# Altium project Athena.PrjPcb
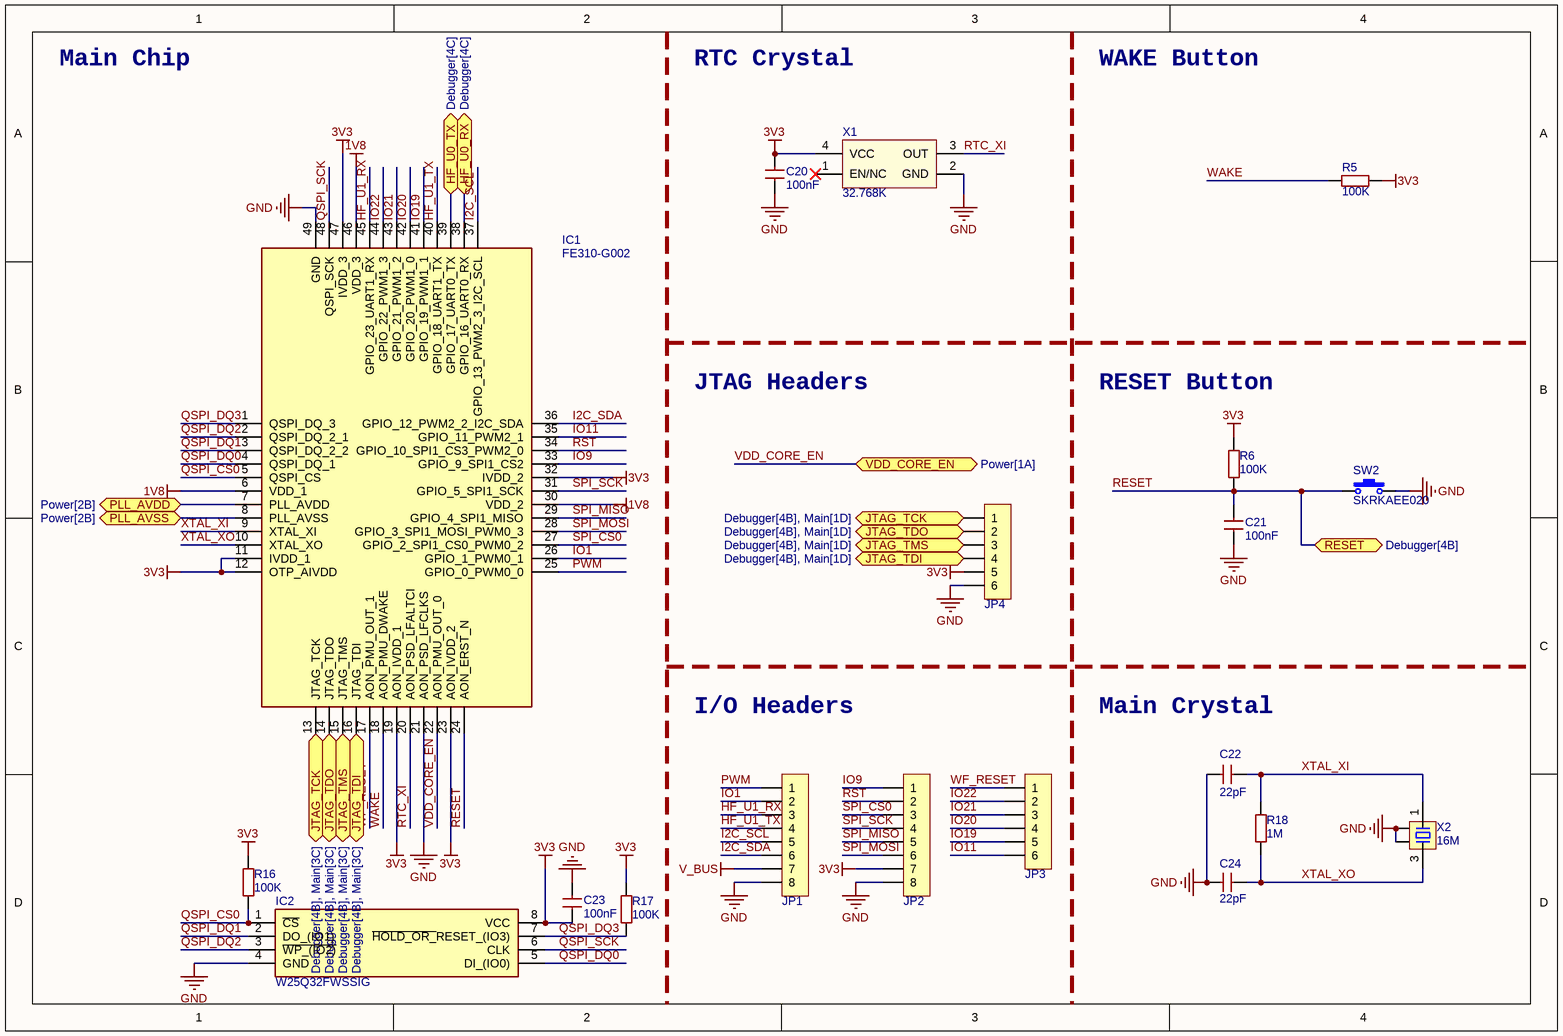
[diagram p0: Main.SchDoc]
3 sheets, 88 parts. Net scope: flat (ports and power ports of the same name join across sheets).
Board file: Board.PcbDoc
Sheets:
  Main.SchDoc
  Power.SchDoc
  Debugger.SchDoc

## Sheet Main.SchDoc
size A4; SheetNumber: 1; SheetTotal: 3

### Parts
C20  100nF  [C0603_NS]
C21  100nF  [C0603_NS]
C22  22pF  [C0603_NS]
C23  100nF  [C0603_NS]
C24  22pF  [C0603_NS]
IC1  FE310-G002  [QFN40P600X600X93-49N]
IC2  W25Q32FWSSIG  [SOIC127P790X216-8N]
JP1  HDR-1X8  [HDR2.54-M-LI-8P]  (value not drawn)
JP2  HDR-1X8  [HDR2.54-M-LI-8P]  (value not drawn)
JP3  HDR-1X6  [HDR2.54-M-LI-6P]  (value not drawn)
JP4  HDR-1X6  [HDR2.54-M-LI-6P]  (value not drawn)
R5  100K  [R0603_NS]
R6  100K  [R0603_NS]
R16  100K  [R0603_NS]
R17  100K  [R0603_NS]
R18  1M  [R0603_NS]
SW2  SKRKAEE020  [SKRKAEE020]
X1  32.768K  [OSC-3225-4P]
X2  16M  [XTAL-3225-4P]

### Ports
HF_U0_RX (bidir, see Debugger[4C]), HF_U0_TX (bidir, see Debugger[4C]), JTAG_TCK (bidir, see Debugger[4B], Main[1D]), JTAG_TCK (bidir, see Debugger[4B], Main[3C]), JTAG_TDI (bidir, see Debugger[4B], Main[1D]), JTAG_TDI (bidir, see Debugger[4B], Main[3C]), JTAG_TDO (bidir, see Debugger[4B], Main[1D]), JTAG_TDO (bidir, see Debugger[4B], Main[3C]), JTAG_TMS (bidir, see Debugger[4B], Main[1D]), JTAG_TMS (bidir, see Debugger[4B], Main[3C]), PLL_AVDD (bidir, see Power[2B]), PLL_AVSS (bidir, see Power[2B]), RESET (bidir, see Debugger[4B]), VDD_CORE_EN (bidir, see Power[1A])

### Nets
1V8: IC1.6(VDD_1) IC1.30(VDD_2) IC1.46(VDD_3)
3V3: C20.2 C23.1 IC1.11(IVDD_1) IC1.12(OTP_AIVDD) IC1.19(AON_IVDD_1) IC1.23(AON_IVDD_2) IC1.32(IVDD_2) IC1.47(IVDD_3) IC2.8(VCC) JP2.7 JP4.5 R5.2 R6.2 R16.2 R17.2 X1.4(VCC)
GND: C20.1 C21.1 C22.1 C23.2 C24.2 IC1.21(AON_PSD_LFCLKS) IC1.49(GND) IC2.4(GND) JP1.8 JP2.8 JP4.6 SW2.2 X1.2(GND) X2.2 X2.4
V_BUS: JP1.7
HF_U1_RX: IC1.45(GPIO_23_UART1_RX) JP1.3
HF_U1_TX: IC1.40(GPIO_18_UART1_TX) JP1.4
I2C_SCL: IC1.37(GPIO_13_PWM2_3_I2C_SCL) JP1.5
I2C_SDA: IC1.36(GPIO_12_PWM2_2_I2C_SDA) JP1.6
IO1: IC1.26(GPIO_1_PWM0_1) JP1.2
IO9: IC1.33(GPIO_9_SPI1_CS2) JP2.1
IO11: IC1.35(GPIO_11_PWM2_1) JP3.6
IO19: IC1.41(GPIO_19_PWM1_1) JP3.5
IO20: IC1.42(GPIO_20_PWM1_0) JP3.4
IO21: IC1.43(GPIO_21_PWM1_2) JP3.3
IO22: IC1.44(GPIO_22_PWM1_3) JP3.2
JTAG_TCK: IC1.13(JTAG_TCK) JP4.1 ; port JTAG_TCK
JTAG_TDI: IC1.16(JTAG_TDI) JP4.4 ; port JTAG_TDI
JTAG_TDO: IC1.14(JTAG_TDO) JP4.2 ; port JTAG_TDO
JTAG_TMS: IC1.15(JTAG_TMS) JP4.3 ; port JTAG_TMS
PLL_AVDD: IC1.7(PLL_AVDD) ; port PLL_AVDD
PLL_AVSS: IC1.8(PLL_AVSS) ; port PLL_AVSS
PWM: IC1.25(GPIO_0_PWM0_0) JP1.1
QSPI_CS0: IC1.5(QSPI_CS) IC2.1(~{CS}) R16.1
QSPI_DQ0: IC1.4(QSPI_DQ_1) IC2.5(DI_(IO0))
QSPI_DQ1: IC1.3(QSPI_DQ_2_2) IC2.2(DO_(IO1))
QSPI_DQ2: IC1.2(QSPI_DQ_2_1) IC2.3(~{WP_(IO2)})
QSPI_DQ3: IC1.1(QSPI_DQ_3) IC2.7(~{HOLD_OR_}RESET_(IO3)) R17.1
QSPI_SCK: IC1.48(QSPI_SCK) IC2.6(CLK)
RESET: C21.2 IC1.24(AON_ERST_N) R6.1 SW2.1 ; port RESET
RST: IC1.34(GPIO_10_SPI1_CS3_PWM2_0) JP2.2
RTC_XI: IC1.20(AON_PSD_LFALTCI) X1.3(OUT)
SPI_CS0: IC1.27(GPIO_2_SPI1_CS0_PWM0_2) JP2.3
SPI_MISO: IC1.29(GPIO_4_SPI1_MISO) JP2.5
SPI_MOSI: IC1.28(GPIO_3_SPI1_MOSI_PWM0_3) JP2.6
SPI_SCK: IC1.31(GPIO_5_SPI1_SCK) JP2.4
UART0_RX: IC1.38(GPIO_16_UART0_RX) ; port HF_U0_RX
UART0_TX: IC1.39(GPIO_17_UART0_TX) ; port HF_U0_TX
VDD_CORE_EN: IC1.22(AON_PMU_OUT_0) ; port VDD_CORE_EN
WAKE: IC1.18(AON_PMU_DWAKE) R5.1
WF_RESET: IC1.17(AON_PMU_OUT_1) JP3.1
XTAL_XI: C22.2 IC1.9(XTAL_XI) R18.2 X2.1
XTAL_XO: C24.1 IC1.10(XTAL_XO) R18.1 X2.3

Not connected (* = marked no-connect by the designer): X1 1(EN/NC)*

### Notes on the sheet
- Main Chip
- RTC Crystal
- WAKE Button
- JTAG Headers
- RESET Button
- I/O Headers
- Main Crystal

### Library data of the parts
C20-C24 = C: 贴片电容/MLCC电容; BOM名称: 无极性贴片电容; 联系卖家，免费查找封装: 唯一出售店铺网址https://shop463601444.taobao.com
IC1 = FE310-G002: Integrated Circuit; Manufacturer_Name: SiFive; Datasheet Link: https://sifive.cdn.prismic.io/sifive%2F3d777659-a0dd-49ed-a011-5bebba17aecf_fe310-g002-ds.pdf; Height: 0.93mm; Manufacturer_Part_Number: FE310-G002
IC2 = W25Q32FWSSIG: Integrated Circuit; Manufacturer_Name: Winbond; Datasheet Link: http://www.winbond.com/resource-files/w25q32fw%20revj%2004242018%20sfdp.pdf; Height: 2.16mm; Manufacturer_Part_Number: W25Q32FWSSIG; Mouser Part Number: 454-W25Q32FWSSIG; Mouser Price/Stock: https://www.mouser.com/Search/Refine.aspx?Keyword=454-W25Q32FWSSIG; Arrow Part Number: W25Q32FWSSIG; Arrow Price/Stock: https://www.arrow.com/en/products/w25q32fwssig/winbond-electronics
JP1 JP2 = Header 8: 8P接插件; 联系卖家，免费查找封装: 唯一出售店铺网址https://shop463601444.taobao.com; 封装库来自淘宝卖家ID:黄晶宝石: 其他店铺购入均为盗版假冒封装库，请立即申请退款，本店现金奖励20~200元; BOM名称: 8P接插件
JP3 JP4 = Header 6: 6P接插件; 联系卖家，免费查找封装: 唯一出售店铺网址https://shop463601444.taobao.com; 封装库来自淘宝卖家ID:黄晶宝石: 其他店铺购入均为盗版假冒封装库，请立即申请退款，本店现金奖励20~200元; BOM名称: 6P接插件
R5 R6 R16-R18 = R: 贴片电阻; 联系卖家，免费查找封装: 唯一出售店铺网址https://shop463601444.taobao.com; BOM名称: 贴片电阻
SW2 = SKRKAEE020: 2.9x3.9轻触开关; BOM名称: 3x6轻触开关; 联系卖家，免费查找封装: 唯一出售店铺网址https://shop463601444.taobao.com; 封装库来自淘宝卖家ID：黄晶宝石: 其他店铺购入的，请立即申请退款，本店现金奖励20~500元
X1 = XTAL-ACT-4P: 4脚有源晶振(振荡器); 联系卖家，免费查找封装: 唯一出售店铺网址https://shop463601444.taobao.com; BOM名称: 有源晶振(振荡器)
X2 = XTAL-4P: 4脚无源晶振(谐振器）; 联系卖家，免费查找封装: 唯一出售店铺网址https://shop463601444.taobao.com; BOM名称: 4脚无源晶振(谐振器）

## Sheet Power.SchDoc
size A4; SheetNumber: 2; SheetTotal: 3
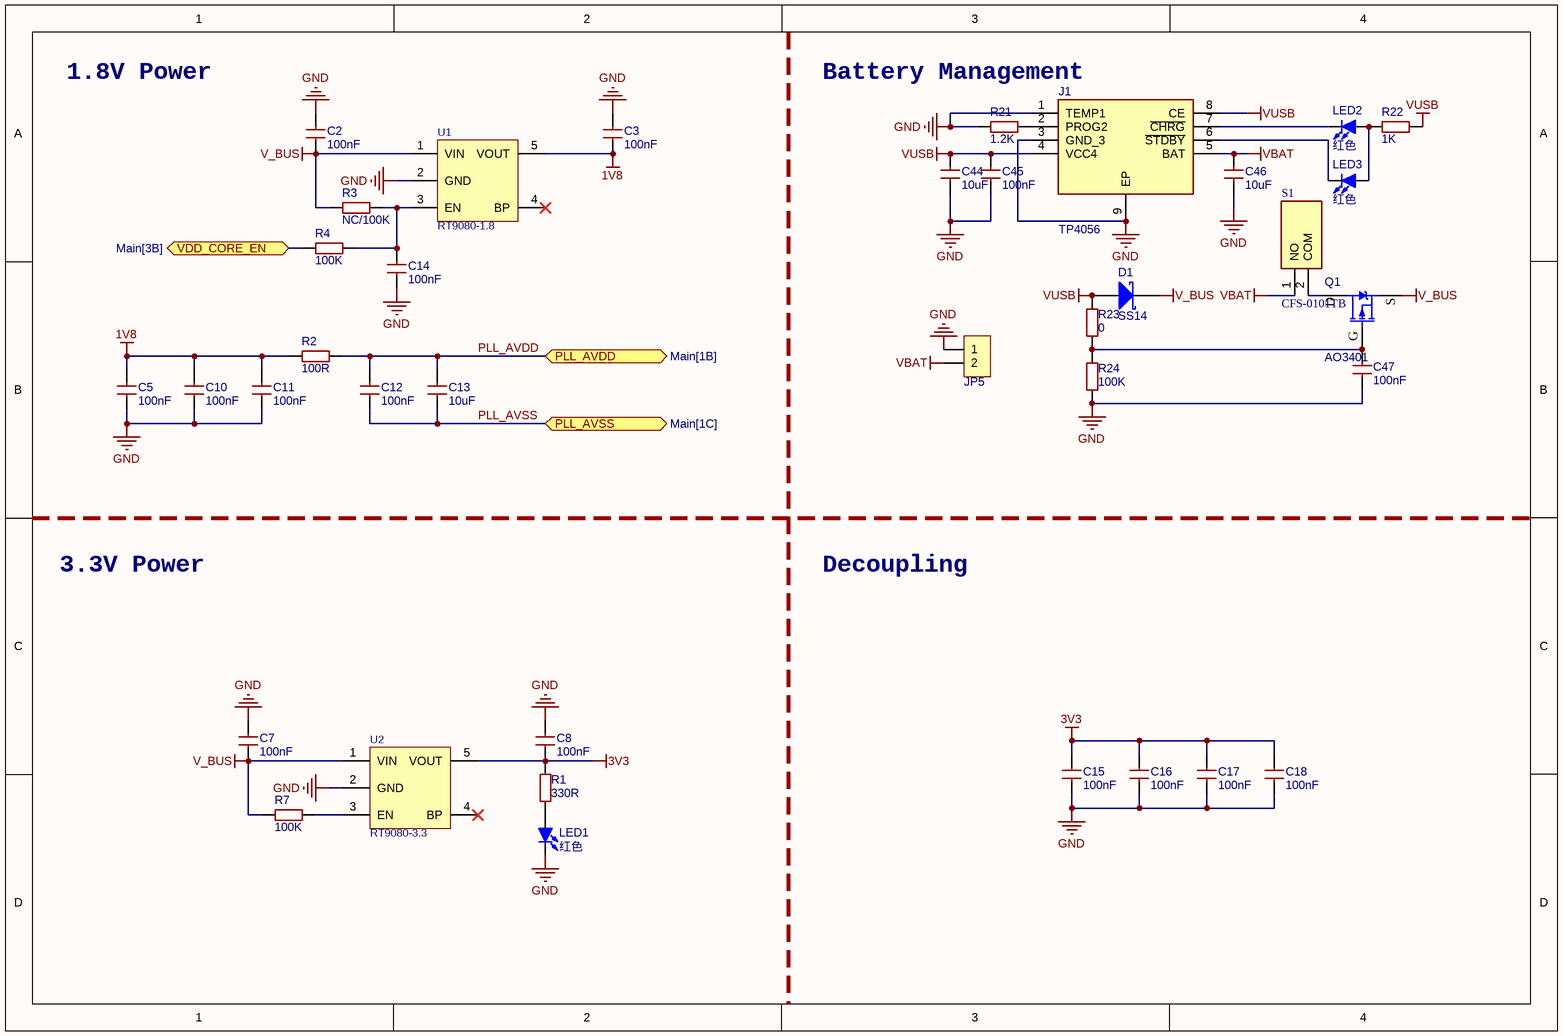
[diagram p1: Power.SchDoc]

### Parts
C2  100nF  [C0603_NS]
C3  100nF  [C0603_NS]
C5  100nF  [C0603_NS]
C7  100nF  [C0603_NS]
C8  100nF  [C0603_NS]
C10  100nF  [C0603_NS]
C11  100nF  [C0603_NS]
C12  100nF  [C0603_NS]
C13  10uF  [C0603_NS]
C14  100nF  [C0603_NS]
C15  100nF  [C0603_NS]
C16  100nF  [C0603_NS]
C17  100nF  [C0603_NS]
C18  100nF  [C0603_NS]
C44  10uF  [C0603_NS]
C45  100nF  [C0603_NS]
C46  10uF  [C0603_NS]
C47  100nF  [C0603_NS]
D1  SS14  [SMA]
J1  TP4056  [SOIC127P600X175-9N]
JP5  HDR-1X2  [XH2.54-LS-2P]  (value not drawn)
LED1  红色  [LED0603_R]
LED2  红色  [LED0603_R]
LED3  红色  [LED0603_R]
Q1  AO3401  [SOT23-3N]
R1  330R  [R0603_NS]
R2  100R  [R0603_NS]
R3  NC/100K  [R0603_NS]
R4  100K  [R0603_NS]
R7  100K  [R0603_NS]
R21  1.2K  [R0603_NS]
R22  1K  [R0603_NS]
R23  0  [R0603_NS]
R24  100K  [R0603_NS]
S1  CFS-0101TB  [CFS0101TB]
U1  RT9080-1.8  [SOT-23-5]
U2  RT9080-3.3  [SOT-23-5]

### Ports
PLL_AVDD (bidir, see Main[1B]), PLL_AVSS (bidir, see Main[1C]), VDD_CORE_EN (bidir, see Main[3B])

### Nets
1V8: C3.1 C5.2 C10.1 C11.2 R2.1 U1.5(VOUT)
3V3: C8.1 C15.2 C16.2 C17.2 C18.2 R1.1 U2.5(VOUT)
GND: C2.2 C3.2 C5.1 C7.2 C8.2 C10.2 C11.1 C14.1 C15.1 C16.1 C17.1 C18.1 C44.1 C45.1 C46.1 C47.1 J1.1(TEMP1) J1.3(GND_3) J1.9(EP) JP5.1 LED1.2(K) R21.1 R24.1 U1.2(GND) U2.2(GND)
V_BUS: C2.1 C7.1 D1.2(K) Q1.2(S) R3.1 R7.1 U1.1(VIN) U2.1(VIN)
VBAT: C46.2 J1.5(BAT) JP5.2 S1.1(NO)
VUSB: C44.2 C45.2 D1.1(A) J1.4(VCC4) J1.8(CE) R22.2 R23.2
PLL_AVDD: C12.2 C13.2 R2.2 ; port PLL_AVDD
PLL_AVSS: C12.1 C13.1 ; port PLL_AVSS
VDD_CORE_EN: R4.1 ; port VDD_CORE_EN
NetC14_2: C14.2 R3.2 R4.2 U1.3(EN)
NetC47_2: C47.2 Q1.1(G) R23.1 R24.2
NetJ1_2: J1.2(PROG2) R21.2
NetJ1_6: J1.6(~{STDBY}) LED3.2(K)
NetJ1_7: J1.7(~{CHRG}) LED2.2(K)
NetLED1_1: LED1.1(A) R1.2
NetLED2_1: LED2.1(A) LED3.1(A) R22.1
NetQ1_3: Q1.3(D) S1.2(COM)
NetR7_2: R7.2 U2.3(EN)

Not connected (* = marked no-connect by the designer): U1 4(BP)*; U2 4(BP)*

### Notes on the sheet
- 1.8V Power
- Battery Management
- 3.3V Power
- Decoupling

### Library data of the parts
C2 C3 C5 C7 C8 C10-C18 C44-C47 = C: as C20 on sheet Main
D1 = SS14: 肖特基二极管; 属性: 40V/1A; 以赠品形式获赠本封装库的买家，还可联系卖家免费指导AD软件使用: 封装库来自淘宝卖家ID：黄晶宝石; BOM名称: 肖特基二极管
J1 = TP4056: Connector; Manufacturer_Name: NanJing Top Power; Datasheet Link: https://dlnmh9ip6v2uc.cloudfront.net/datasheets/Prototyping/TP4056.pdf; Height: 1.75mm; Manufacturer_Part_Number: TP4056
JP5 = Header 2: 2P接插件; 联系卖家，免费查找封装: 唯一出售店铺网址https://shop463601444.taobao.com; 封装库来自淘宝卖家ID:黄晶宝石: 其他店铺购入均为盗版假冒封装库，请立即申请退款，本店现金奖励20~200元; BOM名称: 2P接插件
LED1-LED3 = LED-SMD: 贴片LED; 封装库来自淘宝卖家ID：黄晶宝石: 其他店铺购入均为盗版封装库，请立即申请退款，本店现金奖励20~200元; BOM名称: 贴片LED
Q1 = AO3401: P沟道 30V/4.2A; BOM名称: 场效应管; 8元以下特价购入的买家: 还可以联系卖家远程指导AD软件使用; 参数: P沟道 30V/4.2A
R1-R4 R7 R21-R24 = R: as R5 on sheet Main; BOM名称: 贴片电阻
S1 = CFS-0101TB: Switch; Manufacturer_Name: NIDEC COPAL; Datasheet Link: https://au.mouser.com/datasheet/2/972/cfs-1628139.pdf; Height: 4mm; Manufacturer_Part_Number: CFS-0101TB; Mouser Part Number: 229-CFS-0101TB; Mouser Price/Stock: https://www.mouser.co.uk/ProductDetail/Nidec-Copal/CFS-0101TB?qs=XeJtXLiO41RUoaDpyshzOQ%3D%3D
U1 U2 = RT9193-18GB: LDO 1.8V/0.3A; 芯片厂商: RICHTEK; 封装库来自淘宝卖家ID：黄晶宝石: 其他店铺购入的买家，请立即申请退款，本店现金奖励20~1000元; BOM名称: RT9193-18GB

## Sheet Debugger.SchDoc
size A4; SheetNumber: 3; SheetTotal: 3
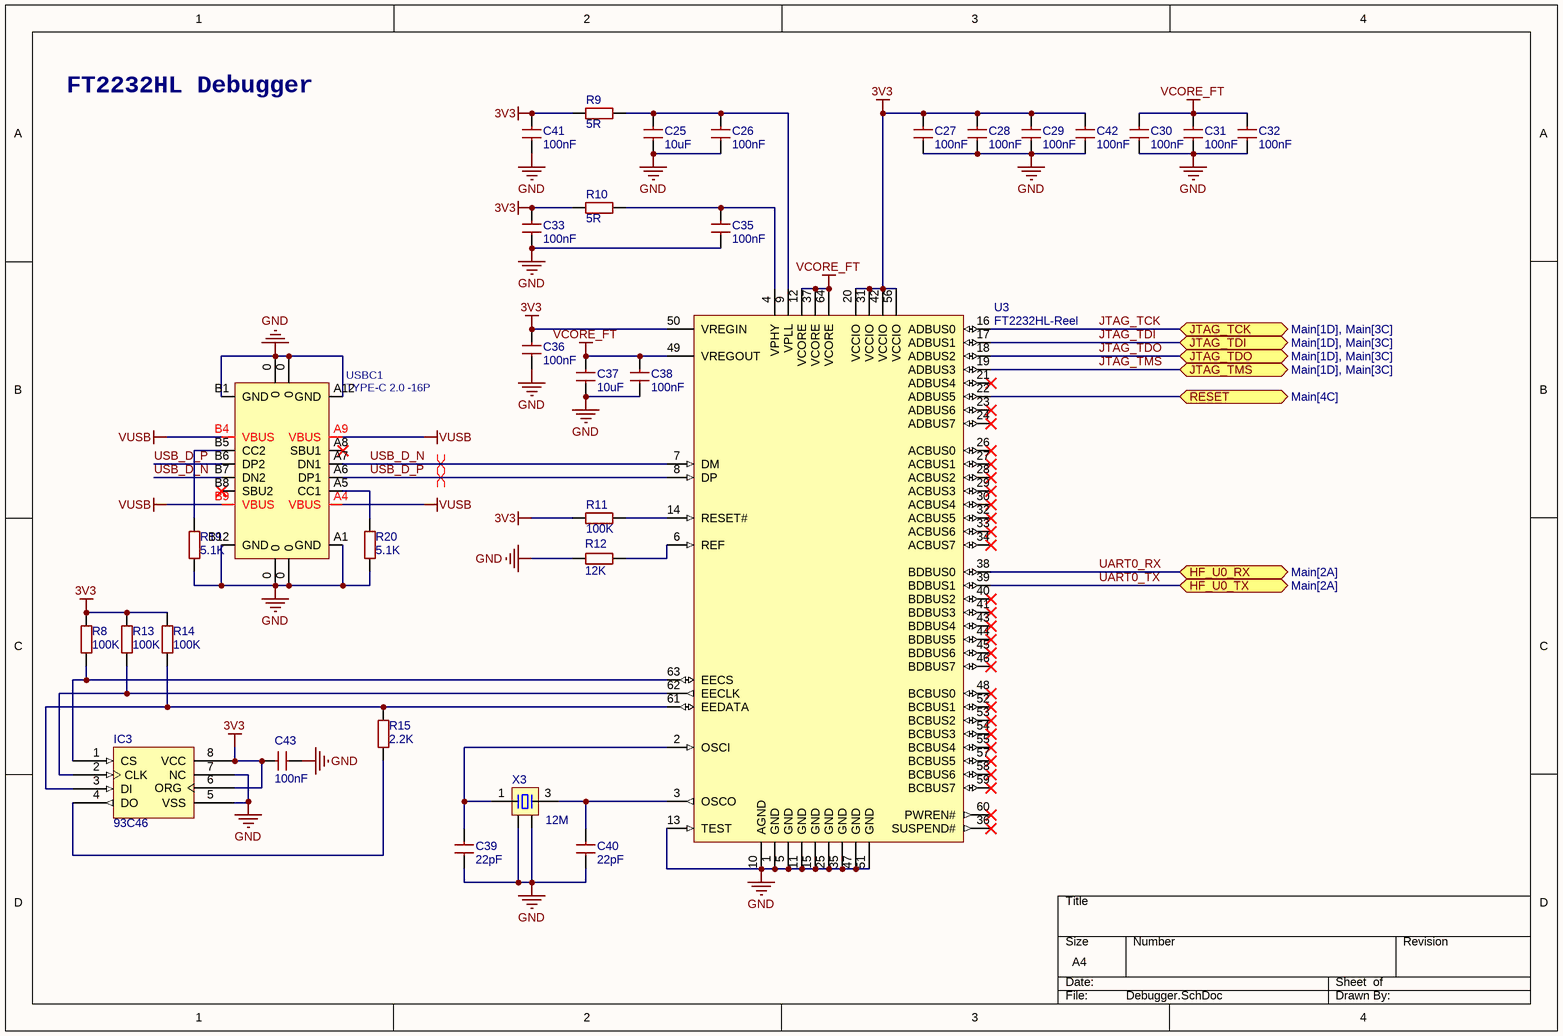
[diagram p2: Debugger.SchDoc]

### Parts
C25  10uF  [C0603_NS]
C26  100nF  [C0603_NS]
C27  100nF  [C0603_NS]
C28  100nF  [C0603_NS]
C29  100nF  [C0603_NS]
C30  100nF  [C0603_NS]
C31  100nF  [C0603_NS]
C32  100nF  [C0603_NS]
C33  100nF  [C0603_NS]
C35  100nF  [C0603_NS]
C36  100nF  [C0603_NS]
C37  10uF  [C0603_NS]
C38  100nF  [C0603_NS]
C39  22pF  [C0603_NS]
C40  22pF  [C0603_NS]
C41  100nF  [C0603_NS]
C42  100nF  [C0603_NS]
C43  100nF  [C0603_NS]
IC3  93C46  [SOP8_L]
R8  100K  [R0603_NS]
R9  5R  [R0603_NS]
R10  5R  [R0603_NS]
R11  100K  [R0603_NS]
R12  12K  [R0603_NS]
R13  100K  [R0603_NS]
R14  100K  [R0603_NS]
R15  2.2K  [R0603_NS]
R19  5.1K  [R0603_NS]
R20  5.1K  [R0603_NS]
U3  FT2232HL-Reel  [LQFP-64_M]
USBC1  TYPE-C 2.0 -16P  [USB-C-SMD_16P]
X3  12M  [XTAL-2025-4P]

### Ports
HF_U0_RX (bidir, see Main[2A]), HF_U0_TX (bidir, see Main[2A]), JTAG_TCK (bidir, see Main[1D], Main[3C]), JTAG_TDI (bidir, see Main[1D], Main[3C]), JTAG_TDO (bidir, see Main[1D], Main[3C]), JTAG_TMS (bidir, see Main[1D], Main[3C]), RESET (bidir, see Main[4C])

### Nets
3V3: C27.2 C28.2 C29.2 C33.2 C36.2 C41.2 C42.2 C43.1 IC3.6(ORG) IC3.8(VCC) R8.2 R9.2 R10.2 R11.2 R13.2 R14.2 U3.20(VCCIO) U3.31(VCCIO) U3.42(VCCIO) U3.50(VREGIN) U3.56(VCCIO)
GND: C25.1 C26.1 C27.1 C28.1 C29.1 C30.1 C31.1 C32.1 C33.1 C35.1 C36.1 C37.1 C38.1 C39.1 C40.1 C41.1 C42.1 C43.2 IC3.5(VSS) IC3.7(NC) R12.1 R19.1 R20.1 U3.1(GND) U3.5(GND) U3.10(AGND) U3.11(GND) U3.13(TEST) U3.15(GND) U3.25(GND) U3.35(GND) U3.47(GND) U3.51(GND) USBC1.0 USBC1.A1(GND) USBC1.A12(GND) USBC1.B1(GND) USBC1.B12(GND) X3.2 X3.4
VCORE_FT: C30.2 C31.2 C32.2 C37.2 C38.2 U3.12(VCORE) U3.37(VCORE) U3.49(VREGOUT) U3.64(VCORE)
VUSB: USBC1.A4(VBUS) USBC1.A9(VBUS) USBC1.B4(VBUS) USBC1.B9(VBUS)
JTAG_TCK: U3.16(ADBUS0) ; port JTAG_TCK
JTAG_TDI: U3.17(ADBUS1) ; port JTAG_TDI
JTAG_TDO: U3.18(ADBUS2) ; port JTAG_TDO
JTAG_TMS: U3.19(ADBUS3) ; port JTAG_TMS
RESET: U3.22(ADBUS5) ; port RESET
UART0_RX: U3.38(BDBUS0) ; port HF_U0_RX
UART0_TX: U3.39(BDBUS1) ; port HF_U0_TX
USB_D_N: U3.7(DM) USBC1.A7(DN1) USBC1.B7(DN2)
USB_D_P: U3.8(DP) USBC1.A6(DP1) USBC1.B6(DP2)
NetC25_2: C25.2 C26.2 R9.1 U3.9(VPLL)
NetC35_2: C35.2 R10.1 U3.4(VPHY)
NetC39_2: C39.2 U3.2(OSCI) X3.1
NetC40_2: C40.2 U3.3(OSCO) X3.3
NetIC3_1: IC3.1(CS) R8.1 U3.63(EECS)
NetIC3_2: IC3.2(CLK) R13.1 U3.62(EECLK)
NetIC3_3: IC3.3(DI) R14.1 R15.1 U3.61(EEDATA)
NetIC3_4: IC3.4(DO) R15.2
NetR11_1: R11.1 U3.14(RESET#)
NetR12_2: R12.2 U3.6(REF)
NetR19_2: R19.2 USBC1.B5(CC2)
NetR20_2: R20.2 USBC1.A5(CC1)

Not connected (* = marked no-connect by the designer): U3 21(ADBUS4)* 23(ADBUS6)* 24(ADBUS7)* 26(ACBUS0)* 27(ACBUS1)* 28(ACBUS2)* 29(ACBUS3)* 30(ACBUS4)* 32(ACBUS5)* 33(ACBUS6)* 34(ACBUS7)* 36(SUSPEND#)* 40(BDBUS2)* 41(BDBUS3)* 43(BDBUS4)* 44(BDBUS5)* 45(BDBUS6)* 46(BDBUS7)* 48(BCBUS0)* 52(BCBUS1)* 53(BCBUS2)* 54(BCBUS3)* 55(BCBUS4)* 57(BCBUS5)* 58(BCBUS6)* 59(BCBUS7)* 60(PWREN#)*; USBC1 A8(SBU1)* B8(SBU2)*

### Layout directives
differential pair: USB_D_N, USB_D_P

### Notes on the sheet
- FT2232HL Debugger

### Library data of the parts
C25-C33 C35-C43 = C: as C20 on sheet Main
IC3 = 93C46: 外置EEPROM; 联系卖家 免费查找封装: 唯一出售店铺网址https://shop463601444.taobao.com; BOM名称: 外置EEPROM
R8-R15 R19 R20 = R: as R5 on sheet Main; BOM名称: 贴片电阻
U3 = CMP-0078-00023-3: Dual High Speed USB To Multipurpose UART/FIFO IC, 64-pin LQFP, Tape and Reel; Manufacturer: FTDI; DatasheetVersion: ver 2.21, Jun-2012; ComponentLink1URL: http://www.ftdichip.com/; PartNumber: FT2232HL-Reel; ComponentLink2Description: Datasheet; RevisionNote: DatasheetVersion updated to 2.21 Jun-2012; PackageVersion: Jun-12; ComponentLink1Description: Manufacturer URL; ComponentLink2URL: http://www.ftdichip.com/Support/Documents/DataSheets/ICs/DS_FT2232H.pdf; PackageReference: LQFP-64; PackageDescription: 64-Pin Thin Quad Flat Pack, 10 x 10 x 1.4 mm Body, 0.5 mm Pitch
USBC1 = USB2.0_Type-C_16Pin: USB2.0_Type-C_16Pin母座; 联系卖家 免费技术支持: 封装库来自淘宝卖家ID：黄晶宝石
X3 = XTAL-4P: as X2 on sheet Main; BOM名称: 4脚无源晶振(谐振器）

## Nets that join several sheets
1V8: Main (IC1.6 IC1.30 IC1.46), Power (6 pins)
3V3: Main (16 pins), Power (7 pins), Debugger (21 pins)
GND: Main (15 pins), Power (25 pins), Debugger (40 pins)
V_BUS: Main (JP1.7), Power (8 pins)
VUSB: Power (7 pins), Debugger (USBC1.A4 USBC1.A9 USBC1.B4 USBC1.B9)
JTAG_TCK: Main (IC1.13 JP4.1), Debugger (U3.16)
JTAG_TDI: Main (IC1.16 JP4.4), Debugger (U3.17)
JTAG_TDO: Main (IC1.14 JP4.2), Debugger (U3.18)
JTAG_TMS: Main (IC1.15 JP4.3), Debugger (U3.19)
PLL_AVDD: Main (IC1.7), Power (C12.2 C13.2 R2.2)
PLL_AVSS: Main (IC1.8), Power (C12.1 C13.1)
RESET: Main (C21.2 IC1.24 R6.1 SW2.1), Debugger (U3.22)
UART0_RX: Main (IC1.38), Debugger (U3.38)
UART0_TX: Main (IC1.39), Debugger (U3.39)
VDD_CORE_EN: Main (IC1.22), Power (R4.1)